# EAGLE design Teensy_backpack (EAGLE 8.0.1)
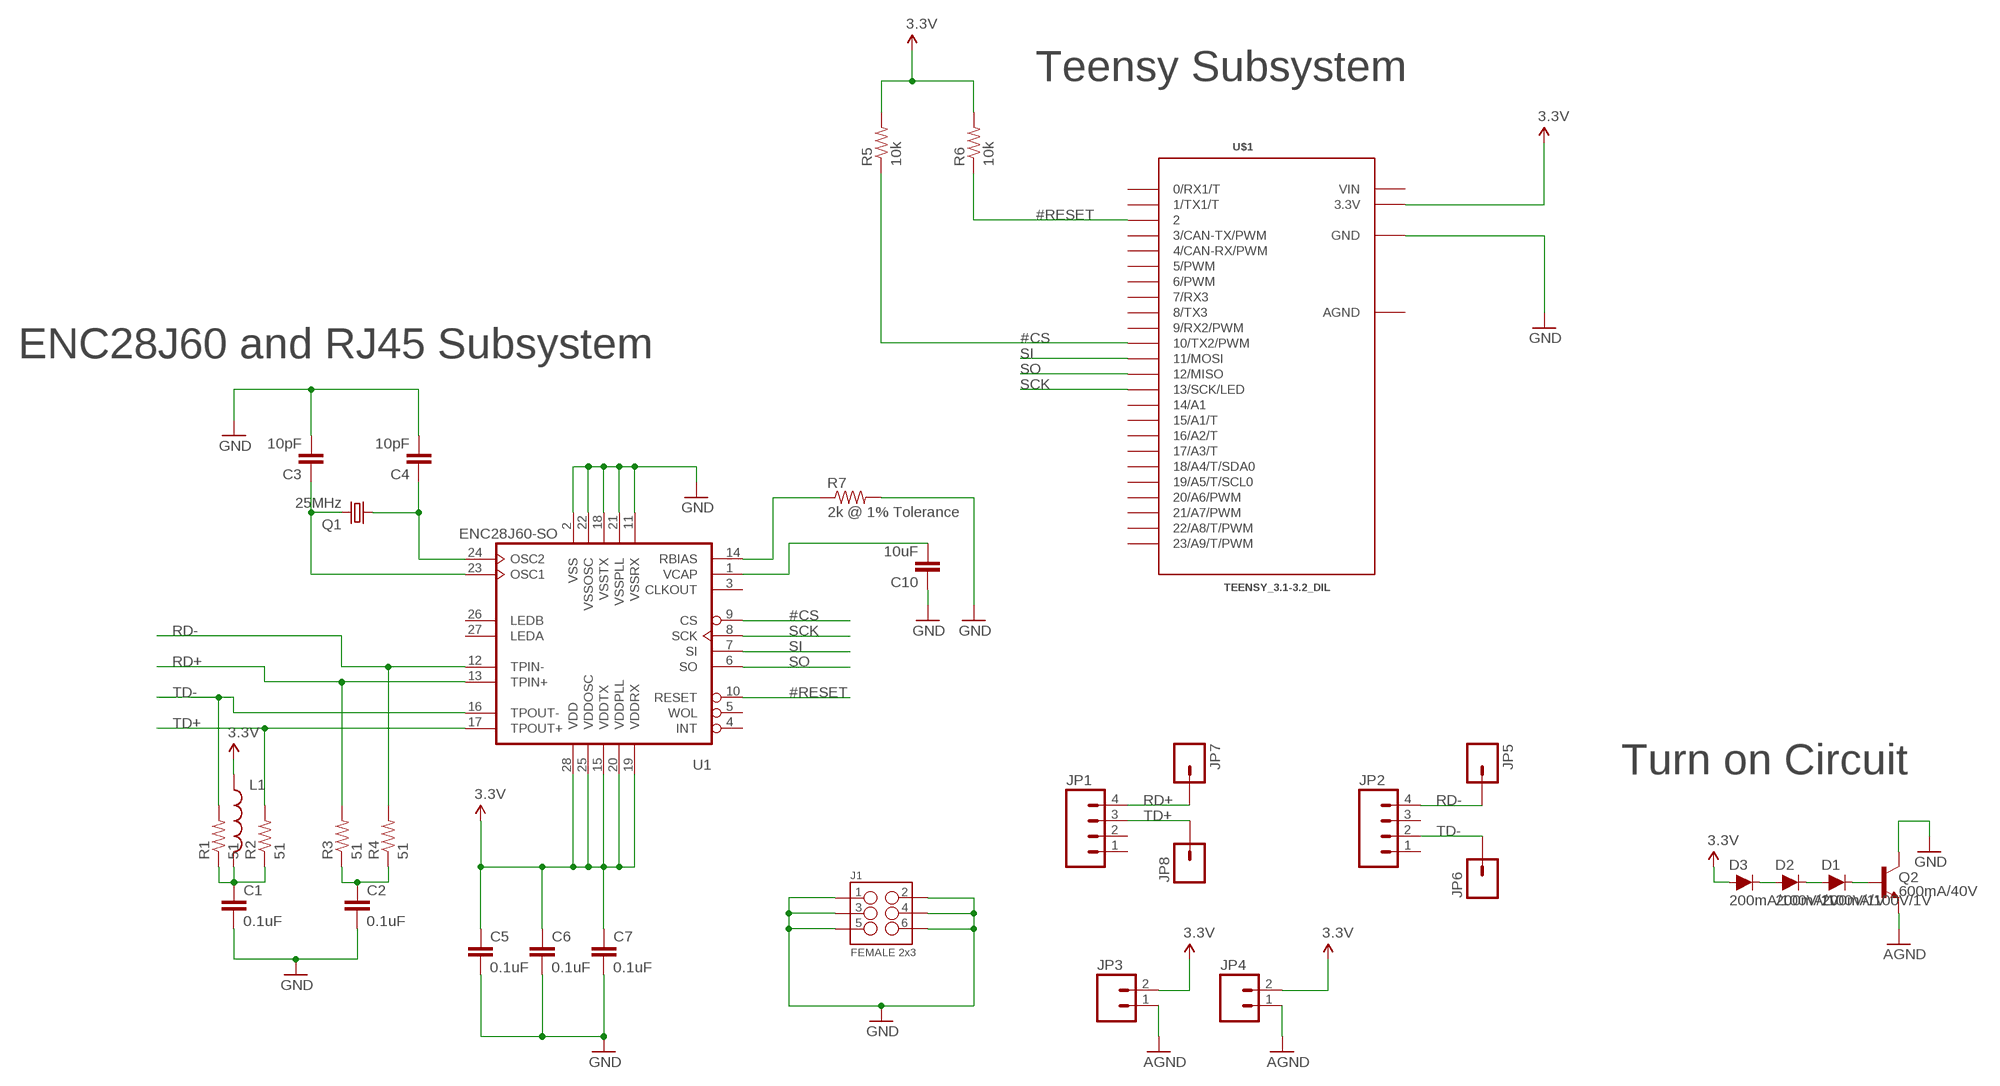
[diagram p0: schematic, sheet 1]

## Parts
C1  0.1uF  CAP0603-CAP  [0603-CAP]
C2  0.1uF  CAP0603-CAP  [0603-CAP]
C3  10pF  CAP0603-CAP  [0603-CAP]
C4  10pF  CAP0603-CAP  [0603-CAP]
C5  0.1uF  CAP0603-CAP  [0603-CAP]
C6  0.1uF  CAP0603-CAP  [0603-CAP]
C7  0.1uF  CAP0603-CAP  [0603-CAP]
C10  10uF  CAP0603-CAP  [0603-CAP]
D1  200mA/100V/1V  DIODE-1N4148  [DIODE-1N4148]
D2  200mA/100V/1V  DIODE-1N4148  [DIODE-1N4148]
D3  200mA/100V/1V  DIODE-1N4148  [DIODE-1N4148]
J1  FEMALE 2x3  M03X2FEMALE  [2X3]
JP1  M04NO_SILK_ALL_ROUND  [1X04_NO_SILK_ALL_ROUND]
JP2  M04NO_SILK_ALL_ROUND  [1X04_NO_SILK_ALL_ROUND]
JP3  M021X02_NO_SILK  [1X02_NO_SILK]
JP4  M021X02_NO_SILK  [1X02_NO_SILK]
JP5  M01NOSILK-KIT  [1X01NS-KIT]
JP6  M01NOSILK-KIT  [1X01NS-KIT]
JP7  M01NOSILK-KIT  [1X01NS-KIT]
JP8  M01NOSILK-KIT  [1X01NS-KIT]
L1  INDUCTOR0603  [0603]
Q1  25MHz  CRYSTALSM49  [SM49]
Q2  600mA/40V  TRANS_NPN-P2N2222A  [TO-92]
R1  51  RESISTOR0603  [0603-RES]
R2  51  RESISTOR0603  [0603-RES]
R3  51  RESISTOR0603  [0603-RES]
R4  51  RESISTOR0603  [0603-RES]
R5  10k  RESISTOR0603  [0603-RES]
R6  10k  RESISTOR0603  [0603-RES]
R7  2k @ 1% Tolerance  RESISTOR0603-RES  [0603-RES]
U1  ENC28J60-SO  [SO28W]
U$1  TEENSY_3.1-3.2_DIL  [TEENSY_3.0-3.2&LC_DIL]

## Nets
3.3V: C5.1 C6.1 C7.1 D3.A JP3.2 JP4.2 L1.1 R5.2 R6.2 U1.15(VDDTX) U1.19(VDDRX) U1.20(VDDPLL) U1.25(VDDOSC) U1.28(VDD) U$1.3.3V
#CS: R5.1 U1.9(CS) U$1.10(10/TX2/PWM)
#RESET: R6.1 U1.10(RESET) U$1.2
AGND: JP3.1 JP4.1 Q2.3(E)
GND: C1.2 C2.2 C3.2 C4.2 C5.2 C6.2 C7.2 C10.1 J1.1 J1.2 J1.3 J1.4 J1.5 J1.6 Q2.1(C) R7.2 U1.2(VSS) U1.11(VSSRX) U1.18(VSSTX) U1.21(VSSPLL) U1.22(VSSOSC) U$1.GND
N$1: D1.A D2.C
N$2: D1.C Q2.2(B)
N$3: D2.A D3.C
N$5: C2.1 R3.1 R4.1
N$7: C1.1 L1.2 R1.1 R2.1
N$12: C3.1 Q1.2 U1.23(OSC1)
N$13: C4.1 Q1.1 U1.24(OSC2)
N$15: R7.1 U1.14(RBIAS)
N$17: C10.2 U1.1(VCAP)
RD+: JP1.4 JP7.1 R3.2 U1.13(TPIN+)
RD-: JP2.4 JP5.1 R4.2 U1.12(TPIN-)
SCK: U1.8(SCK) U$1.13(13/SCK/LED)
SI: U1.7(SI) U$1.11(11/MOSI)
SO: U1.6(SO) U$1.12(12/MISO)
TD+: JP1.3 JP8.1 R2.2 U1.17(TPOUT+)
TD-: JP2.2 JP6.1 R1.2 U1.16(TPOUT-)
Unconnected: JP1.1 JP1.2 JP2.1 JP2.3 U1.3(CLKOUT) U1.4(INT) U1.5(WOL) U1.26(LEDB) U1.27(LEDA) U$1.0(0/RX1/T) U$1.1(1/TX1/T) U$1.3(3/CAN-TX/PWM) U$1.4(4/CAN-RX/PWM) U$1.5(5/PWM) U$1.6(6/PWM) U$1.7(7/RX3) U$1.8(8/TX3) U$1.9(9/RX2/PWM) U$1.14/A0(14/A1) U$1.15/A1(15/A1/T) U$1.16/A2(16/A2/T) U$1.17/A3(17/A3/T) U$1.18/A4(18/A4/T/SDA0) U$1.19/A5(19/A5/T/SCL0) U$1.20/A6(20/A6/PWM) U$1.21/A7(21/A7/PWM) U$1.22/A8(22/A8/T/PWM) U$1.23/A9(23/A9/T/PWM)

## Notes on the sheet
- Teensy Subsystem
- ENC28J60 and RJ45 Subsystem
- Turn on Circuit

## Power pins joined to a net without a drawn wire
AGND: U$1.AGND
VIN: U$1.VIN

## Library data of the parts
C1 C2 C5-C7 = SparkFun-Capacitors:CAP: Capacitor Standard 0603 ceramic capacitor, and 0.1" leaded capacitor.
C3 C4 C10 = SparkFun-Passives:CAP: Capacitor Standard 0603 ceramic capacitor, and 0.1" leaded capacitor.
D1-D3 = SparkFun-DiscreteSemi:DIODE: Diode These are standard reverse protection diodes and small signal diodes. SparkFun Products: SparkFun SparkPunk Sound Kit <https://www.sparkfun.com/products/11177> SparkFun ESP8266 Thing <https://www.sparkfun.com/products/13231>; PROD_ID: DIO-08378
J1 = SparkFun-Connectors:M03X2: 2x3 .1" header. Shrouded, with keying- CONN-10681 SMT- CONN-11415 Pogo pins- HW-11044; PROD_ID: CONN-11566
JP1 JP2 = SparkFun-Connectors:M04: Header 4 Standard 4-pin 0.1" header. Use with straight break away headers (SKU : PRT-00116), right angle break away headers (PRT-00553), swiss pins (PRT-00743), machine pins (PRT-00117), and female headers (PRT-00115). Molex polarized connector foot print use with SKU : PRT-08231 with associated crimp pins and housings. 1MM SMD Version SKU: PRT-10208
JP3 JP4 = SparkFun-Connectors:M02: Standard 2-pin 0.1" header. Use with - straight break away headers ( PRT-00116) - right angle break away headers (PRT-00553) - swiss pins (PRT-00743) - machine pins (PRT-00117) - female headers (PRT-00115) Molex polarized connector foot print use with: PRT-08233 with associated crimp pins and housings. 2.54_SCREWTERM for use with PRT-10571. 3.5mm Screw Terminal footprints for PRT-08084 5mm Screw Terminal footprints for use with PRT-08432
JP5-JP8 = SparkFun-Connectors:M01: Header 1 Standard 1-pin 0.1" header. Use with straight break away headers (SKU : PRT-00116), right angle break away headers (PRT-00553), swiss pins (PRT-00743), machine pins (PRT-00117), and female headers (PRT-00115). SMTSO-256-ET is a "flush mount" nut for a 4-40 screw. The older package used to be too tight, and did not allow it to sit properly thru the drill hit. The latest (0.165DIA) fits nice and snug.
L1 = SparkFun-Passives:INDUCTOR: Inductors Basic Inductor/Choke - 0603 and 1206. Footprints are not proven and vary greatly between part numbers. INDUCTOR POWER 3.3UH 4.0A SMD 0.197" L x 0.197" W x 0.177" H (5.00mm x 5.00mm x 4.50mm)
Q1 = adafruit:CRYSTAL: CRYSTAL; OC_FARNELL: unknown; OC_NEWARK: unknown
Q2 = SparkFun-DiscreteSemi:TRANS_NPN: NPN transistor Current controlled devices typically used to amplify current or used as a switch. BC547 - COM-08928 <http://www.sparkfun.com/products/8928> (TO-92 45V 100mA) (1.Collector 2.Base 3.Emitter) 2N3904 - COM-00521 <http://www.sparkfun.com/products/521> (TO-92 40V 200mA) (1.Emitter 2.Base 3.Collector) P2N2222A - COM-12852 <http://www.sparkfun.com/products/12852> (TO-92 40V 600mA) (1.Collector 2.Base 3.Emitter); PROD_ID: TRANS-09536
R1-R6 = SparkFun-Resistors:RESISTOR: Resistor Basic schematic elements and footprints for 0603, 1206, and PTH resistors.
R7 = SparkFun-Passives:RESISTOR: Resistor Basic schematic elements and footprints for 0603, 1206, and PTH resistors.
U1 = microchip-enc28j60:ENC28J60-*: Microchip 10Mbit Eth. contoller with SPI interface
U$1 = Teensy_3_and_LC_Series_Boards_v1.4:TEENSY_3.1-3.2_DIL: Teensy 3.1 or 3.2 in a DIL Layout.

## Board
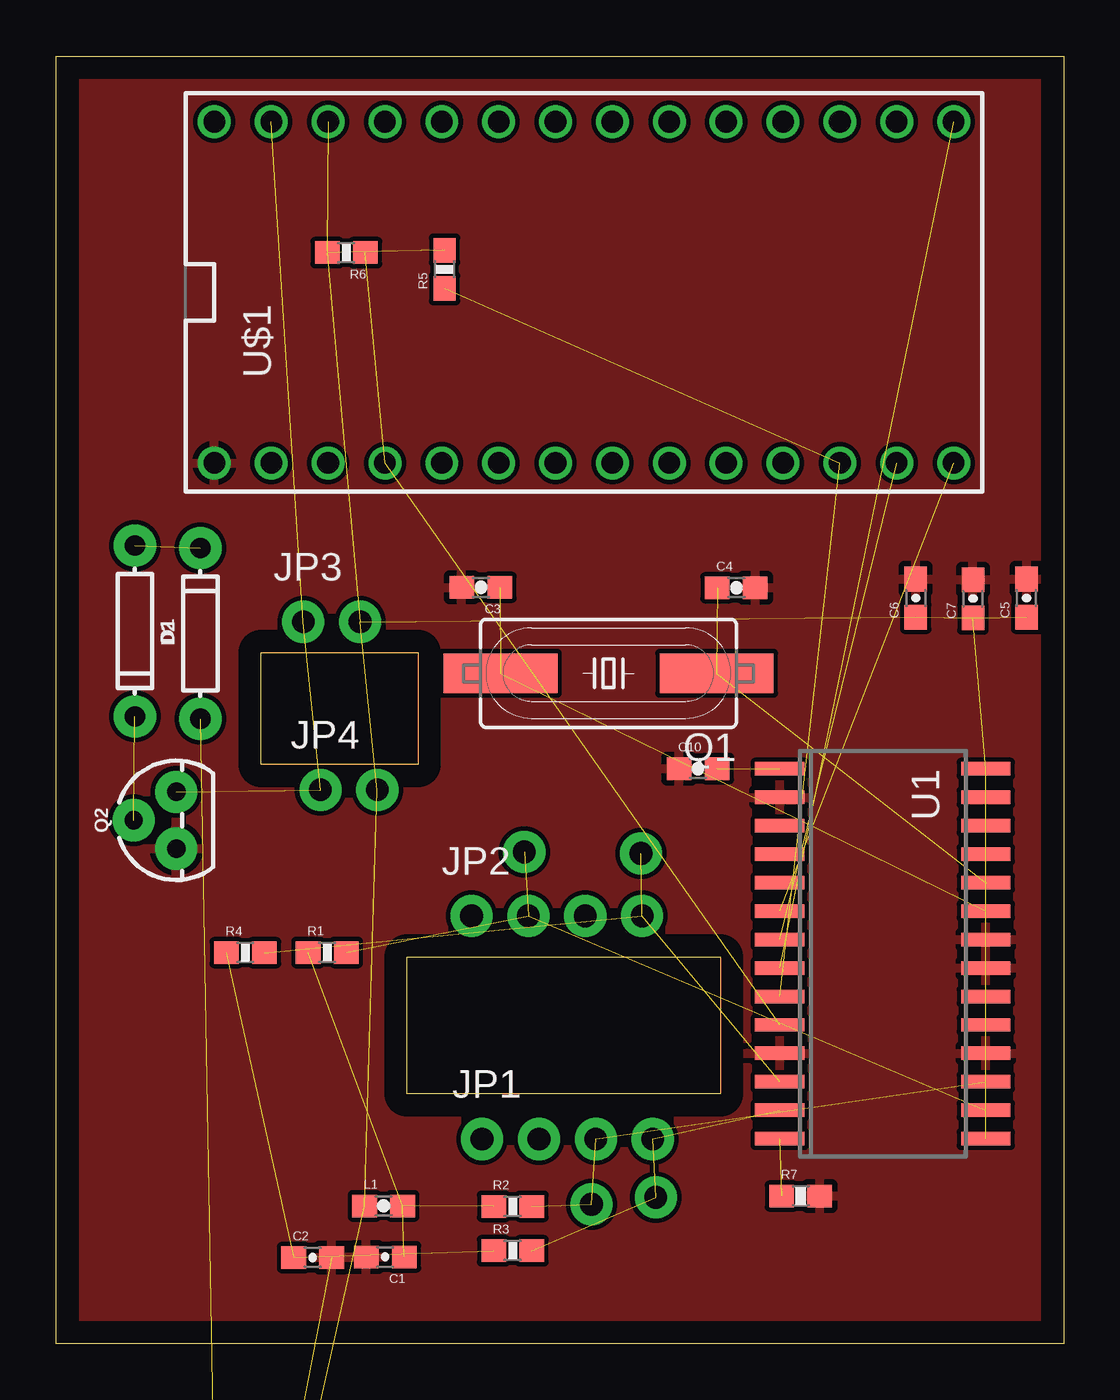
[diagram p1: board, top side]

Size 45 x 57.5 mm. Coordinates in mm from the lower left corner, seen from the top.
Outline: 45,0 0,0 0,57.5 45,57.5 45,0
Outline: 29.67,11.15 15.67,11.15 15.67,17.27 29.67,17.27 29.67,11.15
Outline: 16.16,25.87 9.16,25.87 9.16,30.87 16.16,30.87 16.16,25.87
Copper layers (1*16): Top 0.035mm / dielectric 1.5mm / Bottom 0.035mm
Design rules "default": minimum track width 10mil, minimum drill 24mil, track to track 8mil, track to pad 8mil, pad to pad 8mil, via to via 8mil, smd to smd 8mil, copper to edge 40mil, drill to drill 8mil, minimum pad ring 10mil, minimum via ring 8mil, stop-mask expansion 4mil, vias tented up to drill 0mil, thermal gap 10mil

### Footprints (pad centres in the part's own frame; a part is rotated, then mirrored left to right if it is on the bottom)
0603-CAP = smd 1.1 x 1: 1 -0.85,0; 2 0.85,0
DIODE-1N4148 = drill 0.9 pad 1.88: A -3.81,0; C 3.81,0
2X3 = drill 1.016 pad 1.88 octagon: 1 0,0; 2 0,2.54; 3 2.54,0; 4 2.54,2.54; 5 5.08,0; 6 5.08,2.54
1X04_NO_SILK_ALL_ROUND = drill 1.016 pad 1.88: 1 0,0; 2 2.54,0; 3 5.08,0; 4 7.62,0
1X02_NO_SILK = drill 1.016 pad 1.88: 1 0,0; 2 2.54,0
1X01NS-KIT = drill 1.016 pad 1.88: 1 0,0
0603 = smd 1.1 x 1: 1 -0.85,0; 2 0.85,0
SM49 = smd 5.08 x 1.778: 1 -4.826,0; 2 4.826,0
TO-92 = drill 0.813 pad 1.88: 1 -1.27,0; 2 0,1.905; 3 1.27,0
0603-RES = smd 1.1 x 1: 1 -0.85,0; 2 0.85,0
SO28W = smd 0.6 x 2.2: 1 -8.255,-4.6; 2 -6.985,-4.6; 3 -5.715,-4.6; 4 -4.445,-4.6; 5 -3.175,-4.6; 6 -1.905,-4.6; 7 -0.635,-4.6; 8 0.635,-4.6; 9 1.905,-4.6; 10 3.175,-4.6; 11 4.445,-4.6; 12 5.715,-4.6; 13 6.985,-4.6; 14 8.255,-4.6; 15 8.255,4.6; 16 6.985,4.6; 17 5.715,4.6; 18 4.445,4.6; 19 3.175,4.6; 20 1.905,4.6; 21 0.635,4.6; 22 -0.635,4.6; 23 -1.905,4.6; 24 -3.175,4.6; 25 -4.445,4.6; 26 -5.715,4.6; 27 -6.985,4.6; 28 -8.255,4.6
TEENSY_3.0-3.2&LC_DIL = drill 0.965: 0 -7.62,13.97; 1 -7.62,11.43; 2 -7.62,8.89; 3 -7.62,6.35; 3.3V 7.62,11.43; 4 -7.62,3.81; 5 -7.62,1.27; 6 -7.62,-1.27; 7 -7.62,-3.81; 8 -7.62,-6.35; 9 -7.62,-8.89; 10 -7.62,-11.43; 11 -7.62,-13.97; 12 -7.62,-16.51; 13 7.62,-16.51; 14/A0 7.62,-13.97; 15/A1 7.62,-11.43; 16/A2 7.62,-8.89; 17/A3 7.62,-6.35; 18/A4 7.62,-3.81; 19/A5 7.62,-1.27; 20/A6 7.62,1.27; 21/A7 7.62,3.81; 22/A8 7.62,6.35; 23/A9 7.62,8.89; AGND 7.62,13.97; GND -7.62,16.51; VIN 7.62,16.51

### Placement (x,y rotation side)
C1  14.71,3.87 180 top
C2  11.46,3.84 0 top
C3  18.97,33.77 180 top
C4  30.38,33.75 0 top
C5  43.35,33.29 90 top
C6  38.4,33.29 90 top
C7  40.96,33.26 90 top
C10  28.68,25.68 0 top
D1  3.52,31.82 270 top
D2  6.45,31.71 90 top
D3  4.09,-54 0 top  (outside the outline)
J1  0.19,-35.2 0 top  (outside the outline)
JP1  19.03,9.13 0 top
JP2  18.56,19.09 0 top
JP3  11.05,32.23 0 top
JP4  11.81,24.73 0 top
JP5  26.12,21.88 0 top
JP6  20.92,21.95 0 top
JP7  26.79,6.53 0 top
JP8  23.92,6.21 0 top
L1  14.63,6.15 0 top
Q1  24.68,29.93 180 top
Q2  5.38,23.37 90 top
R1  12.11,17.46 0 top
R2  20.4,6.12 0 top
R3  20.4,4.15 0 top
R4  8.46,17.45 0 top
R5  17.36,47.97 90 top
R6  12.97,48.72 180 top
R7  33.26,6.59 0 top
U1  36.93,17.41 270 top
U$1  23.58,46.94 90 top

### Tracks (layer width: path | path; a pad name or v marks a point on that pad's centre or on a via)
3.3V  (14 unrouted)
#CS  (2 unrouted)
#RESET  (2 unrouted)
AGND  (3 unrouted)
GND  (6 unrouted)
  pour Top: -6.01,65 53.99,65 53.99,-4 -9.01,-4 -9.01,65
N$1  (1 unrouted)
N$2  (1 unrouted)
N$3  (1 unrouted)
N$5  (2 unrouted)
N$7  (3 unrouted)
N$12  (2 unrouted)
N$13  (2 unrouted)
N$15  (1 unrouted)
N$17  (1 unrouted)
RD+  (3 unrouted)
RD-  (3 unrouted)
SCK  (1 unrouted)
SI  (1 unrouted)
SO  (1 unrouted)
TD+  (3 unrouted)
TD-  (3 unrouted)